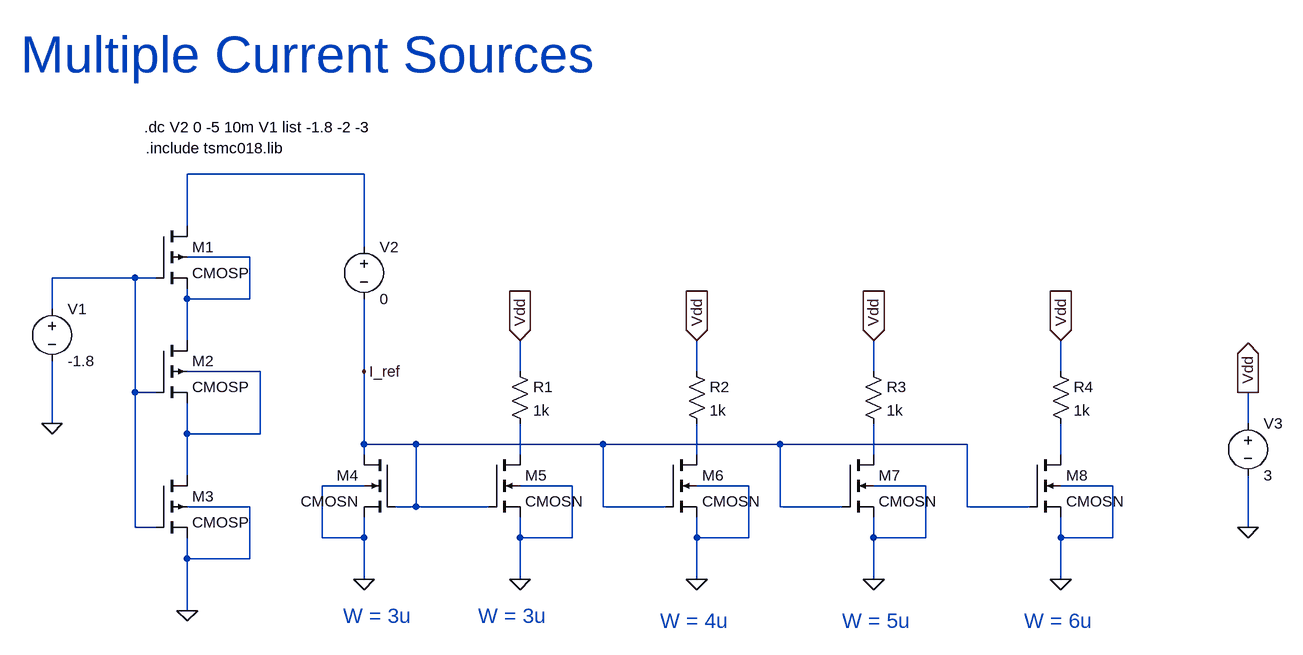
[diagram p0: schematic Multiple current sources.asc]
Multiple current sources.asc, the LTspice schematic file:
Version 4
SHEET 1 1312 680
WIRE -128 -96 -400 -96
WIRE -400 -16 -400 -96
WIRE -128 16 -128 -96
WIRE -304 32 -400 32
WIRE -480 64 -608 64
WIRE -448 64 -480 64
WIRE -400 96 -400 80
WIRE -304 96 -304 32
WIRE -304 96 -400 96
WIRE -608 112 -608 64
WIRE -400 160 -400 96
WIRE -288 208 -400 208
WIRE -128 208 -128 96
WIRE 112 208 112 160
WIRE 384 208 384 160
WIRE 656 208 656 160
WIRE 944 208 944 160
WIRE -480 240 -480 64
WIRE -448 240 -480 240
WIRE -608 288 -608 192
WIRE 1232 288 1232 240
WIRE -400 304 -400 256
WIRE -288 304 -288 208
WIRE -288 304 -400 304
WIRE -128 320 -128 208
WIRE -48 320 -128 320
WIRE 240 320 -48 320
WIRE 512 320 240 320
WIRE 800 320 512 320
WIRE -128 336 -128 320
WIRE 112 336 112 288
WIRE 384 336 384 288
WIRE 656 336 656 288
WIRE 944 336 944 288
WIRE -400 368 -400 304
WIRE -128 384 -192 384
WIRE 192 384 112 384
WIRE 464 384 384 384
WIRE 736 384 656 384
WIRE 1024 384 944 384
WIRE -304 416 -400 416
WIRE -48 416 -48 320
WIRE -48 416 -80 416
WIRE 64 416 -48 416
WIRE 240 416 240 320
WIRE 336 416 240 416
WIRE 512 416 512 320
WIRE 608 416 512 416
WIRE 800 416 800 320
WIRE 896 416 800 416
WIRE -480 448 -480 240
WIRE -448 448 -480 448
WIRE 1232 448 1232 368
WIRE -192 464 -192 384
WIRE -128 464 -128 432
WIRE -128 464 -192 464
WIRE 112 464 112 432
WIRE 192 464 192 384
WIRE 192 464 112 464
WIRE 384 464 384 432
WIRE 464 464 464 384
WIRE 464 464 384 464
WIRE 656 464 656 432
WIRE 736 464 736 384
WIRE 736 464 656 464
WIRE 944 464 944 432
WIRE 1024 464 1024 384
WIRE 1024 464 944 464
WIRE -400 496 -400 464
WIRE -304 496 -304 416
WIRE -304 496 -400 496
WIRE -128 528 -128 464
WIRE 112 528 112 464
WIRE 384 528 384 464
WIRE 656 528 656 464
WIRE 944 528 944 464
WIRE -400 576 -400 496
FLAG -608 288 0
FLAG -128 528 0
FLAG 112 528 0
FLAG 1232 448 0
FLAG -400 576 0
FLAG 1232 240 Vdd
IOPIN 1232 240 Out
FLAG 112 160 Vdd
IOPIN 112 160 In
FLAG 384 528 0
FLAG 384 160 Vdd
IOPIN 384 160 In
FLAG 656 528 0
FLAG 656 160 Vdd
IOPIN 656 160 In
FLAG 944 528 0
FLAG 944 160 Vdd
IOPIN 944 160 In
FLAG -128 208 I_ref
SYMBOL cmosp -448 -16 R0
SYMATTR InstName M1
SYMATTR Value2 l=1u w=5u
SYMBOL voltage -608 96 R0
WINDOW 123 0 0 Left 2
WINDOW 39 0 0 Left 2
SYMATTR InstName V1
SYMATTR Value -1.8
SYMBOL cmosp -448 160 R0
SYMATTR InstName M2
SYMATTR Value2 l=1u w=5u
SYMBOL cmosp -448 368 R0
SYMATTR InstName M3
SYMATTR Value2 l=1u w=5u
SYMBOL voltage -128 0 R0
WINDOW 123 0 0 Left 2
WINDOW 39 0 0 Left 2
SYMATTR InstName V2
SYMATTR Value 0
SYMBOL cmosn -80 336 M0
SYMATTR InstName M4
SYMATTR Value2 l=1u w=3u
SYMBOL cmosn 64 336 R0
SYMATTR InstName M5
SYMATTR Value2 l=1u w=3u
SYMBOL res 96 192 R0
SYMATTR InstName R1
SYMATTR Value 1k
SYMBOL voltage 1232 272 R0
WINDOW 123 0 0 Left 2
WINDOW 39 0 0 Left 2
SYMATTR InstName V3
SYMATTR Value 3
SYMBOL cmosn 336 336 R0
SYMATTR InstName M6
SYMATTR Value2 l=1u w=4u
SYMBOL res 368 192 R0
SYMATTR InstName R2
SYMATTR Value 1k
SYMBOL cmosn 608 336 R0
SYMATTR InstName M7
SYMATTR Value2 l=1u w=5u
SYMBOL res 640 192 R0
SYMATTR InstName R3
SYMATTR Value 1k
SYMBOL cmosn 896 336 R0
SYMATTR InstName M8
SYMATTR Value2 l=1u w=6u
SYMBOL res 928 192 R0
SYMATTR InstName R4
SYMATTR Value 1k
TEXT -464 -136 Left 2 !.include tsmc018.lib
TEXT -466 -168 Left 2 !.dc V2 0 -5 10m V1 list -1.8 -2 -3
TEXT -160 584 Left 3 ;W = 3u
TEXT 48 584 Left 3 ;W = 3u
TEXT 328 592 Left 3 ;W = 4u
TEXT 608 592 Left 3 ;W = 5u
TEXT 888 592 Left 3 ;W = 6u
TEXT -656 -280 Left 6 ;Multiple Current Sources

The netlist it stands for:
* Multiple current sources.asc
M1 N001 N003 N002 N002 CMOSP l=1u w=5u
V1 N003 0 -1.8
M2 N002 N003 N004 N004 CMOSP l=1u w=5u
M3 N004 N003 0 0 CMOSP l=1u w=5u
V2 N001 I_ref 0
M4 I_ref I_ref 0 0 CMOSN l=1u w=3u
M5 N005 I_ref 0 0 CMOSN l=1u w=3u
R1 Vdd N005 1k
V3 Vdd 0 3
M6 N006 I_ref 0 0 CMOSN l=1u w=4u
R2 Vdd N006 1k
M7 N007 I_ref 0 0 CMOSN l=1u w=5u
R3 Vdd N007 1k
M8 N008 I_ref 0 0 CMOSN l=1u w=6u
R4 Vdd N008 1k
.model NMOS NMOS
.model PMOS PMOS
.lib standard.mos
.include tsmc018.lib
.dc V2 0 -5 10m V1 list -1.8 -2 -3
* W = 3u
* W = 3u
* W = 4u
* W = 5u
* W = 6u
* Multiple Current Sources
.backanno
.end